# EAGLE design test_circuit1 (EAGLE 6.3)
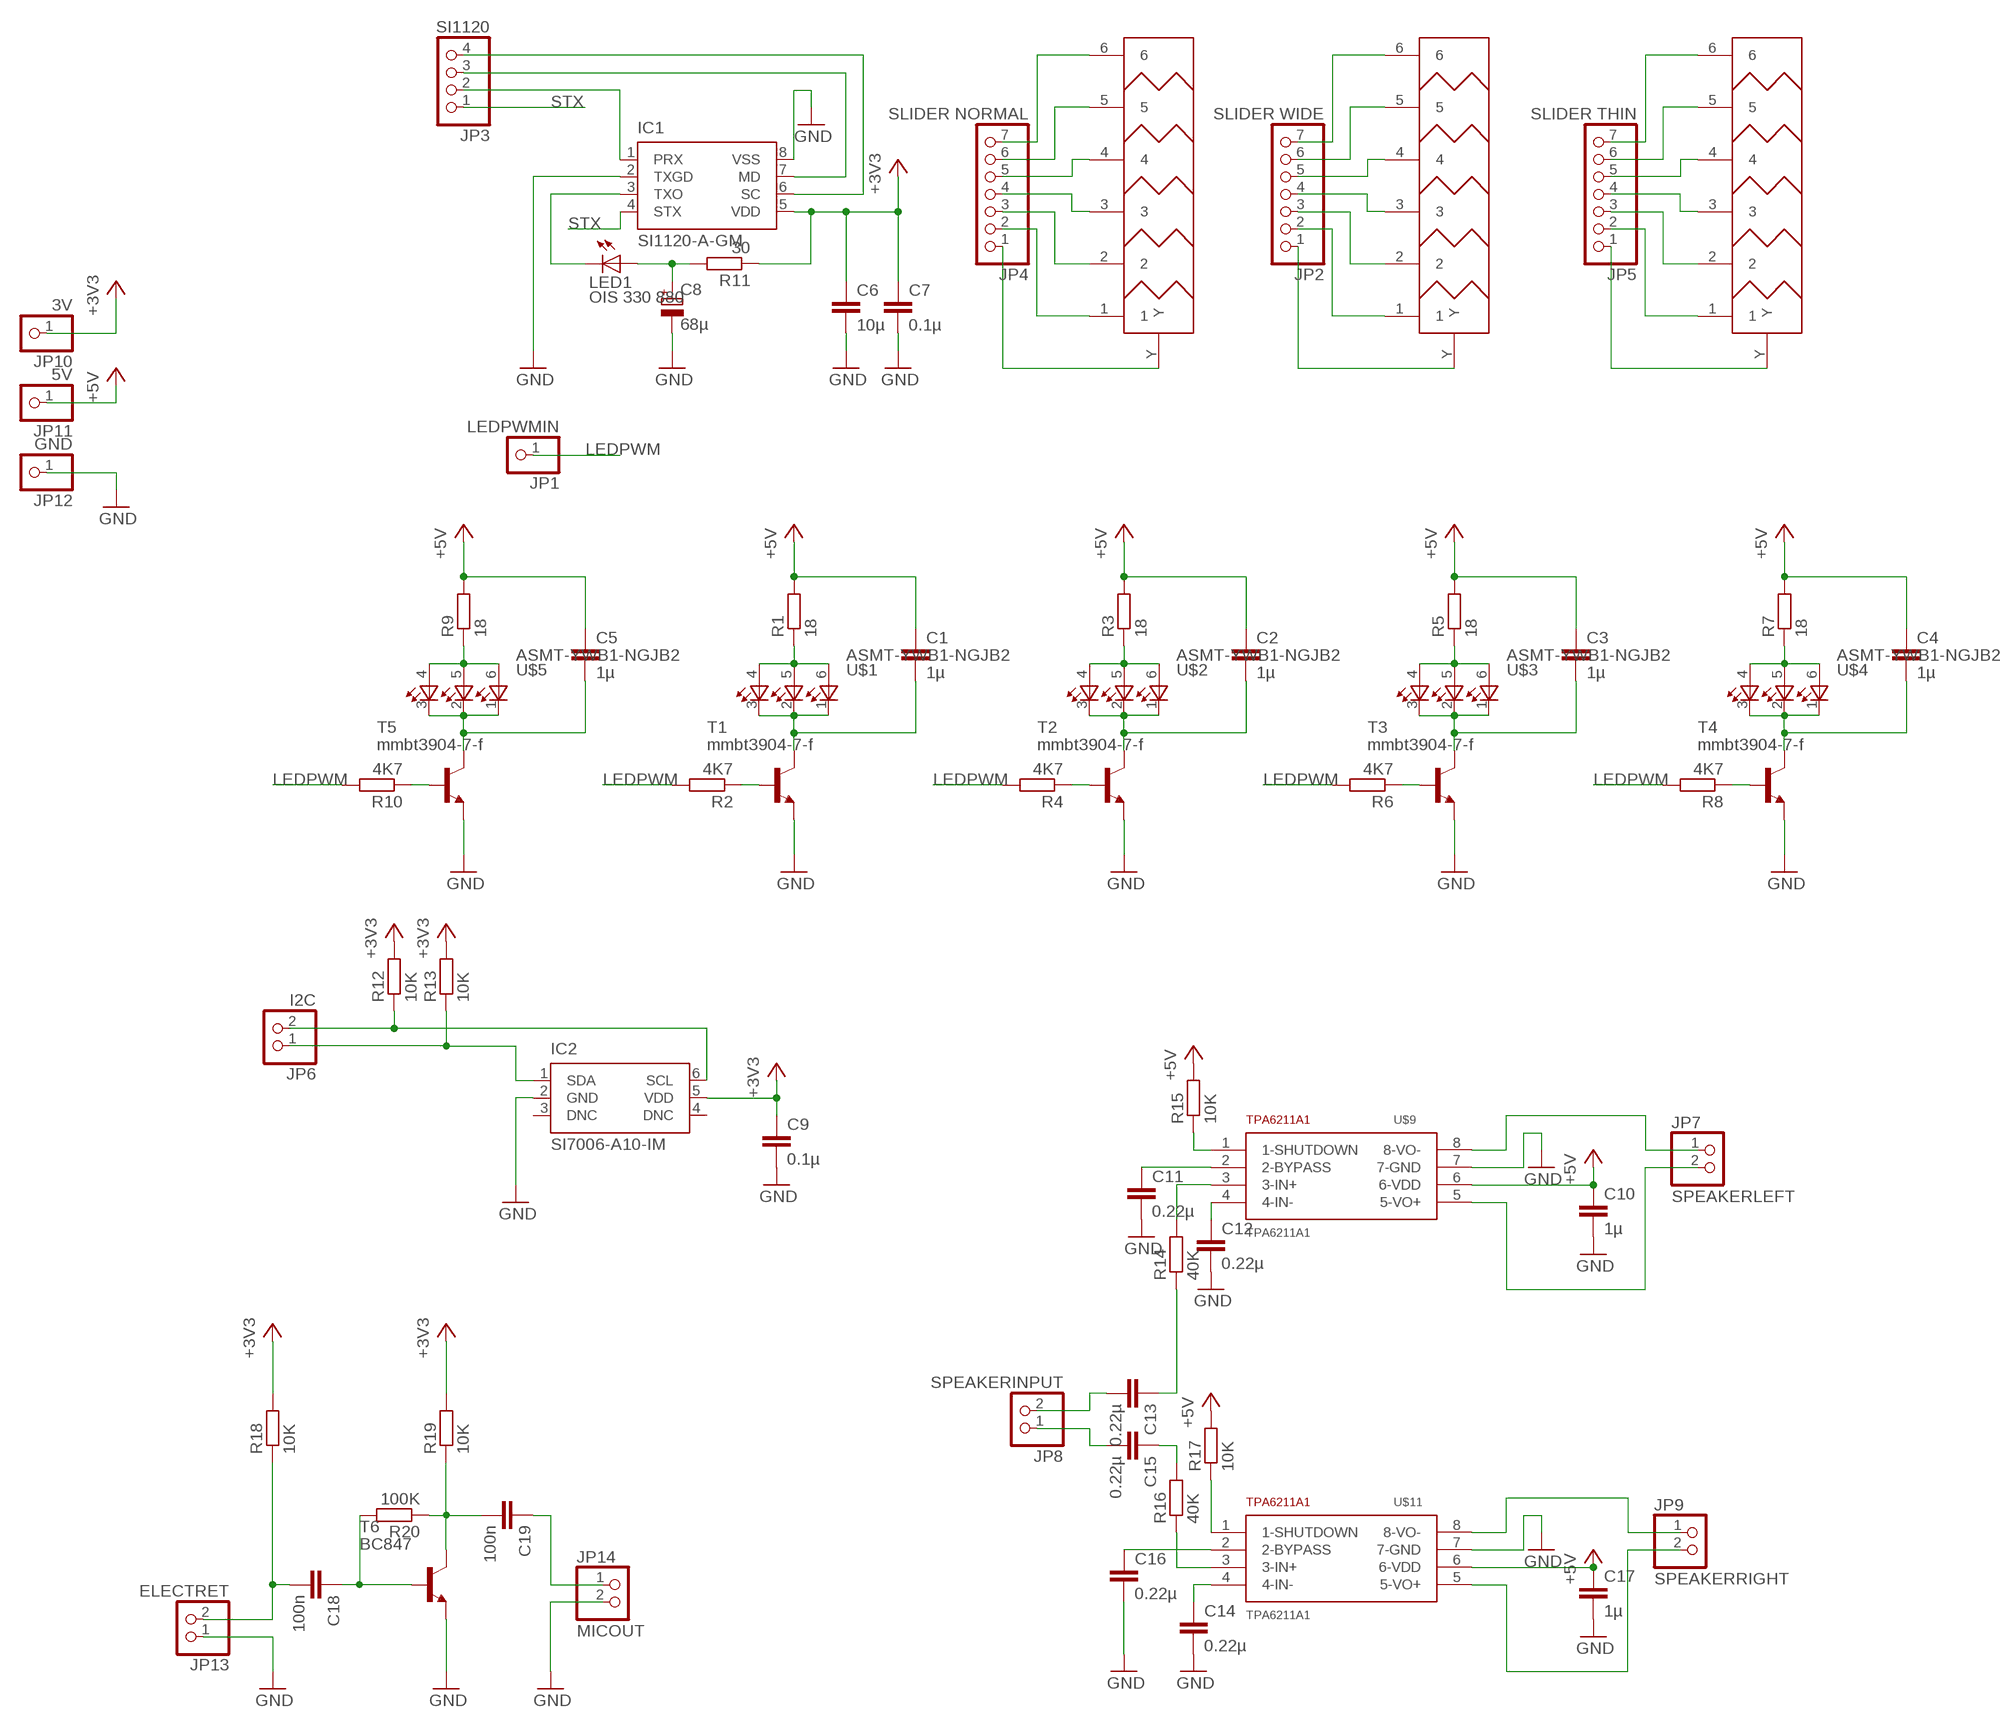
[diagram p0: schematic, sheet 1]

## Parts
C1  1µ  C-EUC0805  [C0805]
C2  1µ  C-EUC0805  [C0805]
C3  1µ  C-EUC0805  [C0805]
C4  1µ  C-EUC0805  [C0805]
C5  1µ  C-EUC0805  [C0805]
C6  10µ  C-EUC0805  [C0805]
C7  0.1µ  C-EUC0805  [C0805]
C8  68µ  CPOL-EUE2.5-7  [E2,5-7]
C9  0.1µ  C-EUC0805  [C0805]
C10  1µ  C-EUC0805  [C0805]
C11  0.22µ  C-EUC0805  [C0805]
C12  0.22µ  C-EUC0805  [C0805]
C13  0.22µ  C-EUC0805  [C0805]
C14  0.22µ  C-EUC0805  [C0805]
C15  0.22µ  C-EUC0805  [C0805]
C16  0.22µ  C-EUC0805  [C0805]
C17  1µ  C-EUC0805  [C0805]
C18  100n  C-EUC0805  [C0805]
C19  100n  C-EUC0805  [C0805]
IC1  SI1120-A-GM  [ODFN8-3X3]
IC2  SI7006-A10-IM  [DFN6-3X3]
JP1  LEDPWMIN  PINHD-1X1  [1X01]
JP2  SLIDER WIDE  PINHD-1X7  [1X07]
JP3  SI1120  PINHD-1X4  [1X04]
JP4  SLIDER NORMAL  PINHD-1X7  [1X07]
JP5  SLIDER THIN  PINHD-1X7  [1X07]
JP6  I2C  PINHD-1X2  [1X02]
JP7  SPEAKERLEFT  PINHD-1X2  [1X02]
JP8  SPEAKERINPUT  PINHD-1X2  [1X02]
JP9  SPEAKERRIGHT  PINHD-1X2  [1X02]
JP10  3V  PINHD-1X1  [1X01]
JP11  5V  PINHD-1X1  [1X01]
JP12  GND  PINHD-1X1  [1X01]
JP13  ELECTRET  PINHD-1X2  [1X02]
JP14  MICOUT  PINHD-1X2  [1X02]
LED1  OIS 330 880  LEDSML1206  [SML1206]
R1  18  R-EU_R0805  [R0805]
R2  4K7  R-EU_R0805  [R0805]
R3  18  R-EU_R0805  [R0805]
R4  4K7  R-EU_R0805  [R0805]
R5  18  R-EU_R0805  [R0805]
R6  4K7  R-EU_R0805  [R0805]
R7  18  R-EU_R0805  [R0805]
R8  4K7  R-EU_R0805  [R0805]
R9  18  R-EU_R0805  [R0805]
R10  4K7  R-EU_R0805  [R0805]
R11  30  R-EU_R0805  [R0805]
R12  10K  R-EU_R0805  [R0805]
R13  10K  R-EU_R0805  [R0805]
R14  40K  R-EU_R0805  [R0805]
R15  10K  R-EU_R0805  [R0805]
R16  40K  R-EU_R0805  [R0805]
R17  10K  R-EU_R0805  [R0805]
R18  10K  R-EU_R0805  [R0805]
R19  10K  R-EU_R0805  [R0805]
R20  100K  R-EU_R0805  [R0805]
T1  mmbt3904-7-f  -NPN-SOT23-EBC  [SOT23-EBC]
T2  mmbt3904-7-f  -NPN-SOT23-EBC  [SOT23-EBC]
T3  mmbt3904-7-f  -NPN-SOT23-EBC  [SOT23-EBC]
T4  mmbt3904-7-f  -NPN-SOT23-EBC  [SOT23-EBC]
T5  mmbt3904-7-f  -NPN-SOT23-EBC  [SOT23-EBC]
T6  BC847  [SOT23]
U$1  ASMT-YWB1-NGJB2  [ASMT-YWB1-NGJB2]
U$2  ASMT-YWB1-NGJB2  [ASMT-YWB1-NGJB2]
U$3  ASMT-YWB1-NGJB2  [ASMT-YWB1-NGJB2]
U$4  ASMT-YWB1-NGJB2  [ASMT-YWB1-NGJB2]
U$5  ASMT-YWB1-NGJB2  [ASMT-YWB1-NGJB2]
U$6  SLIDER160MM_RESINT  [SLIDER160MM_RI]
U$7  SLIDER16MM_RESINT_WIDEY  [SLIDER160MM_RI_WIDERY]
U$8  SLIDER160MM_RESINT_THIN  [SLIDER160MM_RI_THIN]
U$9  TPA6211A1  [MSOP8]
U$11  TPA6211A1  [MSOP8]

## Nets
+3V3: C6.1 C7.1 C9.1 IC1.5(VDD) IC2.5(VDD) JP10.1 R11.1 R12.2 R13.2 R18.2 R19.2
+5V: C1.1 C2.1 C3.1 C4.1 C5.1 C10.1 C17.1 JP11.1 R1.2 R3.2 R5.2 R7.2 R9.2 R15.2 R17.2 U$9.6(6-VDD) U$11.6(6-VDD)
GND: C6.2 C7.2 C8.- C9.2 C10.2 C11.2 C12.2 C14.2 C16.2 C17.2 IC1.2(TXGD) IC1.8(VSS) IC2.2(GND) JP12.1 JP13.1 JP14.2 T1.E T2.E T3.E T4.E T5.E T6.2(E) U$9.7(7-GND) U$11.7(7-GND)
LEDPWM: JP1.1 R2.2 R4.2 R6.2 R8.2 R10.2
N$1: R1.1 U$1.4 U$1.5 U$1.6
N$2: C1.2 T1.C U$1.1 U$1.2 U$1.3
N$3: C2.2 T2.C U$2.1 U$2.2 U$2.3
N$4: R3.1 U$2.4 U$2.5 U$2.6
N$5: R2.1 T1.B
N$6: R4.1 T2.B
N$7: C3.2 T3.C U$3.1 U$3.2 U$3.3
N$8: R5.1 U$3.4 U$3.5 U$3.6
N$9: R6.1 T3.B
N$10: C4.2 T4.C U$4.1 U$4.2 U$4.3
N$11: R7.1 U$4.4 U$4.5 U$4.6
N$12: R8.1 T4.B
N$13: C5.2 T5.C U$5.1 U$5.2 U$5.3
N$14: R9.1 U$5.4 U$5.5 U$5.6
N$15: R10.1 T5.B
N$16: JP4.7 U$6.6
N$17: JP4.6 U$6.5
N$18: JP4.5 U$6.4
N$19: JP4.4 U$6.3
N$20: JP4.3 U$6.2
N$21: JP4.2 U$6.1
N$22: IC1.3(TXO) LED1.C
N$23: C8.+ LED1.A R11.2
N$24: IC1.7(MD) JP3.3
N$25: IC1.6(SC) JP3.4
N$26: IC1.1(PRX) JP3.2
N$27: JP4.1 U$6.Y
N$28: JP2.7 U$7.6
N$29: JP2.6 U$7.5
N$30: JP2.5 U$7.4
N$31: JP2.4 U$7.3
N$32: JP2.3 U$7.2
N$33: JP2.2 U$7.1
N$34: JP2.1 U$7.Y
N$35: JP5.7 U$8.6
N$36: JP5.6 U$8.5
N$37: JP5.5 U$8.4
N$38: JP5.4 U$8.3
N$39: JP5.3 U$8.2
N$40: JP5.2 U$8.1
N$41: JP5.1 U$8.Y
N$42: C13.1 R14.1
N$43: C13.2 JP8.2
N$44: IC2.6(SCL) JP6.2 R12.1
N$45: IC2.1(SDA) JP6.1 R13.1
N$46: JP7.1 U$9.8(8-VO-)
N$47: JP7.2 U$9.5(5-VO+)
N$48: C11.1 U$9.2(2-BYPASS)
N$49: C12.1 U$9.4(4-IN-)
N$50: R14.2 U$9.3(3-IN+)
N$51: C15.2 JP8.1
N$52: C15.1 R16.2
N$53: R15.1 U$9.1(1-SHUTDOWN)
N$54: R16.1 U$11.3(3-IN+)
N$55: C14.1 U$11.4(4-IN-)
N$56: C16.1 U$11.2(2-BYPASS)
N$57: R17.1 U$11.1(1-SHUTDOWN)
N$58: JP9.1 U$11.8(8-VO-)
N$59: JP9.2 U$11.5(5-VO+)
N$60: C19.2 R19.1 R20.1 T6.3(C)
N$65: C18.1 R20.2 T6.1(B)
N$66: C18.2 JP13.2 R18.1
N$67: C19.1 JP14.1
STX: IC1.4(STX) JP3.1
Unconnected: IC2.3(DNC) IC2.4(DNC)

## Library data of the parts
C1-C7 C9-C19 = resistor:C-EU: CAPACITOR, European symbol
C8 = resistor:CPOL-EU: POLARIZED CAPACITOR, European symbol
IC1 = si11xx_10:SI1120-*: Proximity/Light Sensor with PWM Output Source: http://www.silabs.com/Support%20Documents/TechnicalDocs/Si1120.pdf; MF: Silicon Labs; MPN: Si1120-A-GM; OC_FARNELL: 2422557; OC_NEWARK: unknown
IC2 = si70xx-10:SI7006-*: I2C Humidity and Temperature Sensor Source: http://www.silabs.com/Support%20Documents/TechnicalDocs/Si7006-A10.pdf; MF: Silicon Labs; MPN: Si7006-A10-IM; OC_FARNELL: unknown; OC_NEWARK: unknown
JP1 JP10-JP12 = pinhead:PINHD-1X1: PIN HEADER
JP2 JP4 JP5 = pinhead:PINHD-1X7: PIN HEADER
JP3 = pinhead:PINHD-1X4: PIN HEADER
JP6-JP9 JP13 JP14 = pinhead:PINHD-1X2: PIN HEADER
LED1 = led:LED: LED OSRAM: - CHIPLED LG R971, LG N971, LY N971, LG Q971, LY Q971, LO R971, LY R971 LH N974, LH R974 LS Q976, LO Q976, LY Q976 LO Q996 - Hyper CHIPLED LW Q18S LB Q993, LB Q99A, LB R99A - SideLED LS A670, LO A670, LY A670, LG A670, LP A670 LB A673, LV A673, LT A673, LW A673 LH A674 LY A675 LS A676, LA A676, LO A676, LY A676, LW A676 LS A679, LY A679, LG A679 - Hyper Micro SIDELED® LS Y876, LA Y876, LO Y876, LY Y876 LT Y87S - SmartLED LW L88C, LW L88S LB L89C, LB L89S, LG L890 LS L89K, LO L89K, LY L89K LS L896, LA L896, LO L896, LY L896 - TOPLED LS T670, LO T670, LY T670, LG T670, LP T670 LSG T670, LSP T670, LSY T670, LOP T670, LYG T670 LG T671, LOG T671, LSG T671 LB T673, LV T673, LT T673, LW T673 LH T674 LS T676, LA T676, LO T676, LY T676, LB T676, LH T676, LSB T676, LW T676 LB T67C, LV T67C, LT T67C, LS T67K, LO T67K, LY T67K, LW E67C LS E67B, LA E67B, LO E67B, LY E67B, LB E67C, LV E67C, LT E67C LW T67C LS T679, LY T679, LG T679 LS T770, LO T770, LY T770, LG T770, LP T770 LB T773, LV T773, LT T773, LW T773 LH T774 LS E675, LA E675, LY E675, LS T675 LS T776, LA T776, LO T776, LY T776, LB T776 LHGB T686 LT T68C, LB T68C - Hyper Mini TOPLED® LB M676 - Mini TOPLED Santana® LG M470 LS M47K, LO M47K, LY M47K Source: http://www.osram.convergy.de LUXEON: - LUMILED® LXK2-PW12-R00, LXK2-PW12-S00, LXK2-PW14-U00, LXK2-PW14-V00 LXK2-PM12-R00, LXK2-PM12-S00, LXK2-PM14-U00 LXK2-PE12-Q00, LXK2-PE12-R00, LXK2-PE12-S00, LXK2-PE14-T00, LXK2-PE14-U00 LXK2-PB12-K00, LXK2-PB12-L00, LXK2-PB12-M00, LXK2-PB14-N00, LXK2-PB14-P00, LXK2-PB14-Q00 LXK2-PR12-L00, LXK2-PR12-M00, LXK2-PR14-Q00, LXK2-PR14-R00 LXK2-PD12-Q00, LXK2-PD12-R00, LXK2-PD12-S00 LXK2-PH12-R00, LXK2-PH12-S00 LXK2-PL12-P00, LXK2-PL12-Q00, LXK2-PL12-R00 Source: www.luxeon.com KINGBRIGHT: KA-3528ASYC Source: www.kingbright.com
R1-R20 = resistor:R-EU_: RESISTOR, European symbol
T1-T5 = transistor:*-NPN-: NPN Transistror BF959 corrected 2008.03.06
T6 = transistor:BC847: NPN TRANSISTOR
U$1-U$5 = alarm:ASMT-YWB1-NGJB2
U$6 = alarm:SLIDER160MM_RESINT
U$7 = alarm:SLIDER16MM_RESINT_WIDEY
U$8 = alarm:SLIDER160MM_RESINT_THIN
U$9 U$11 = alarm:TPA6211A1

## Board
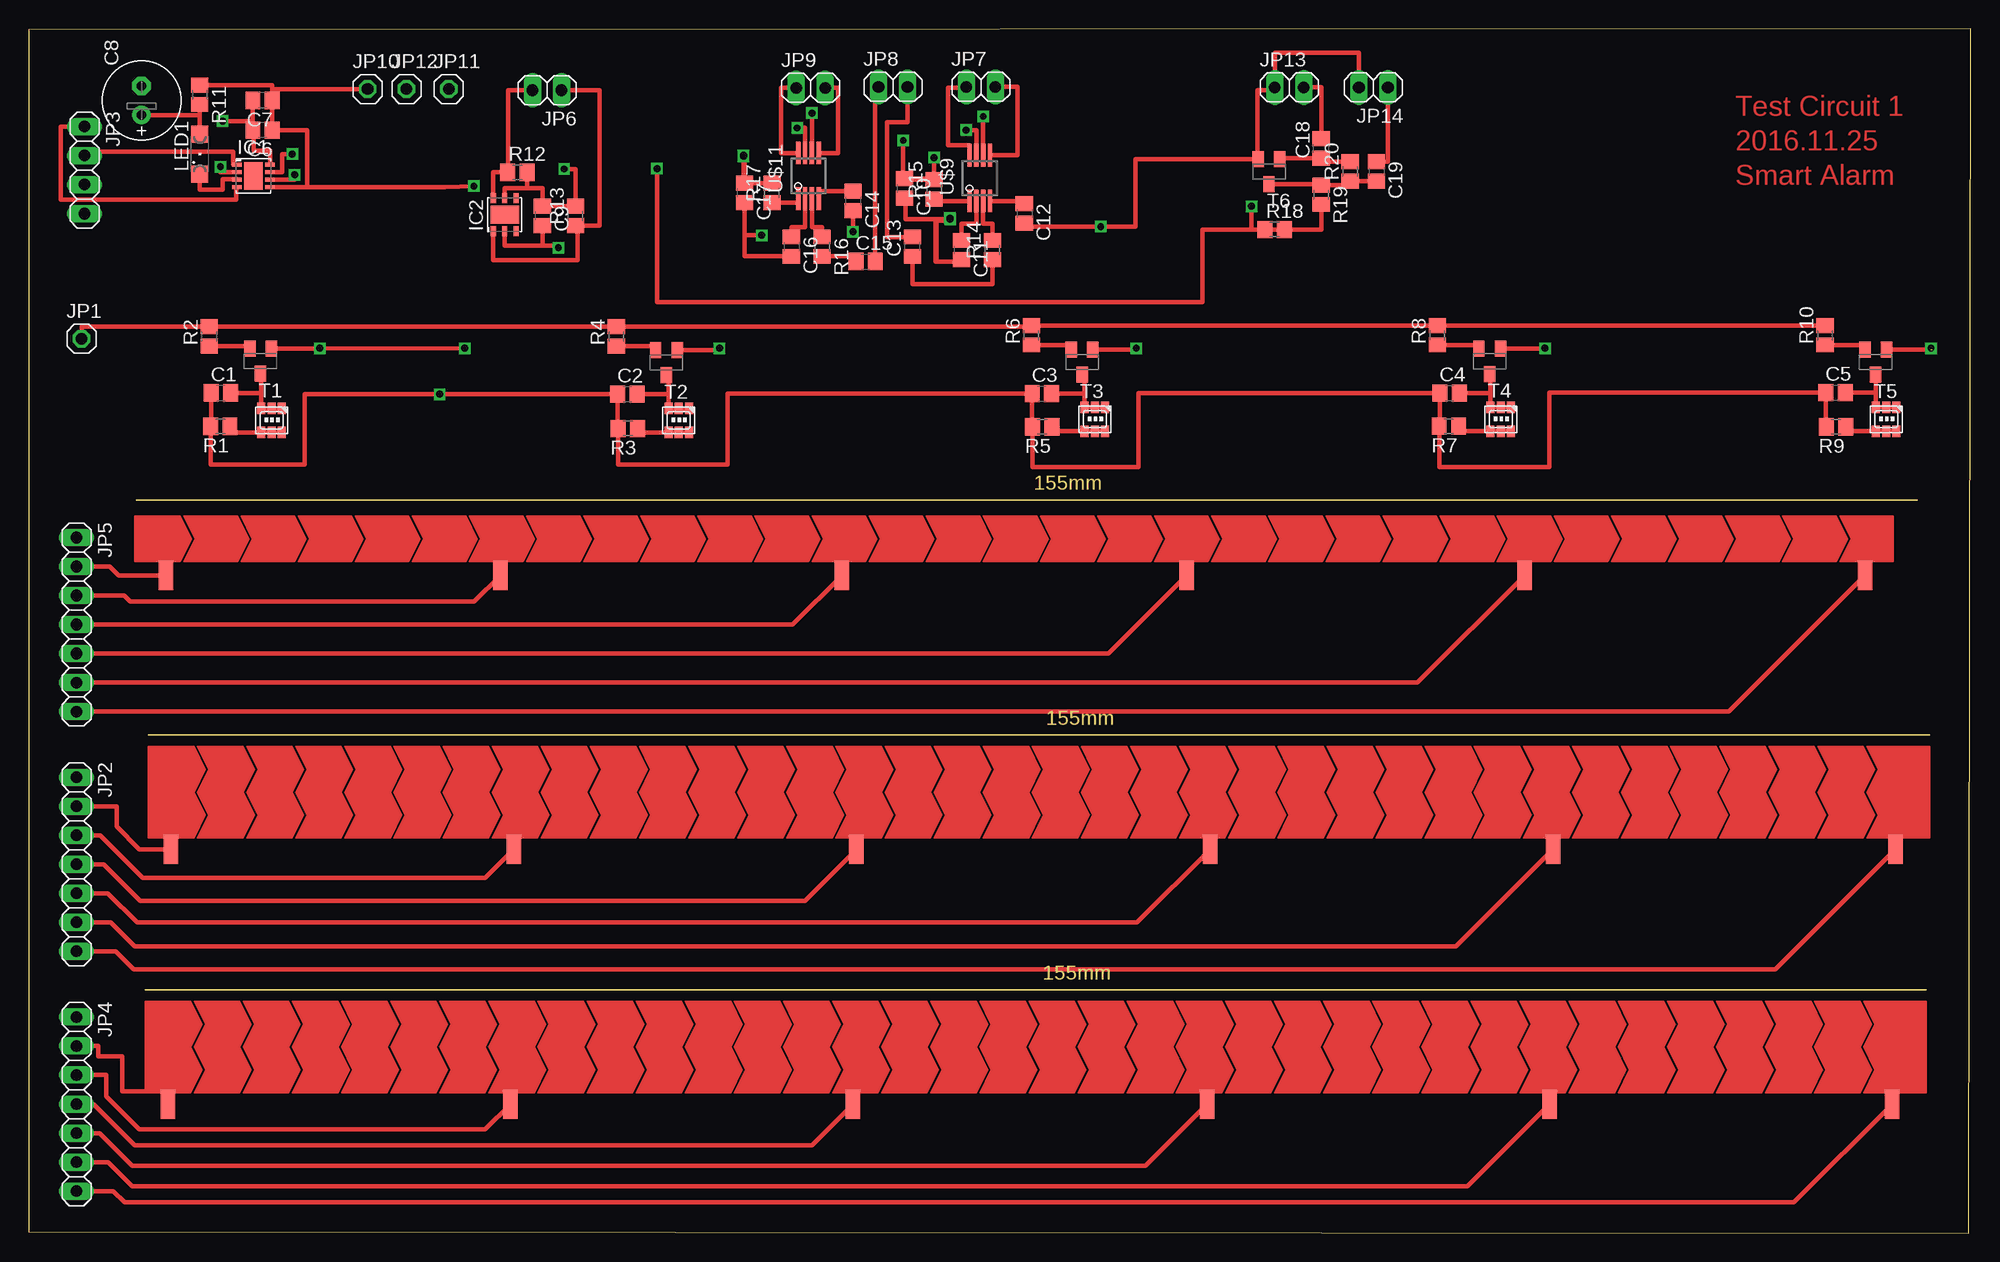
[diagram p1: board, top side]
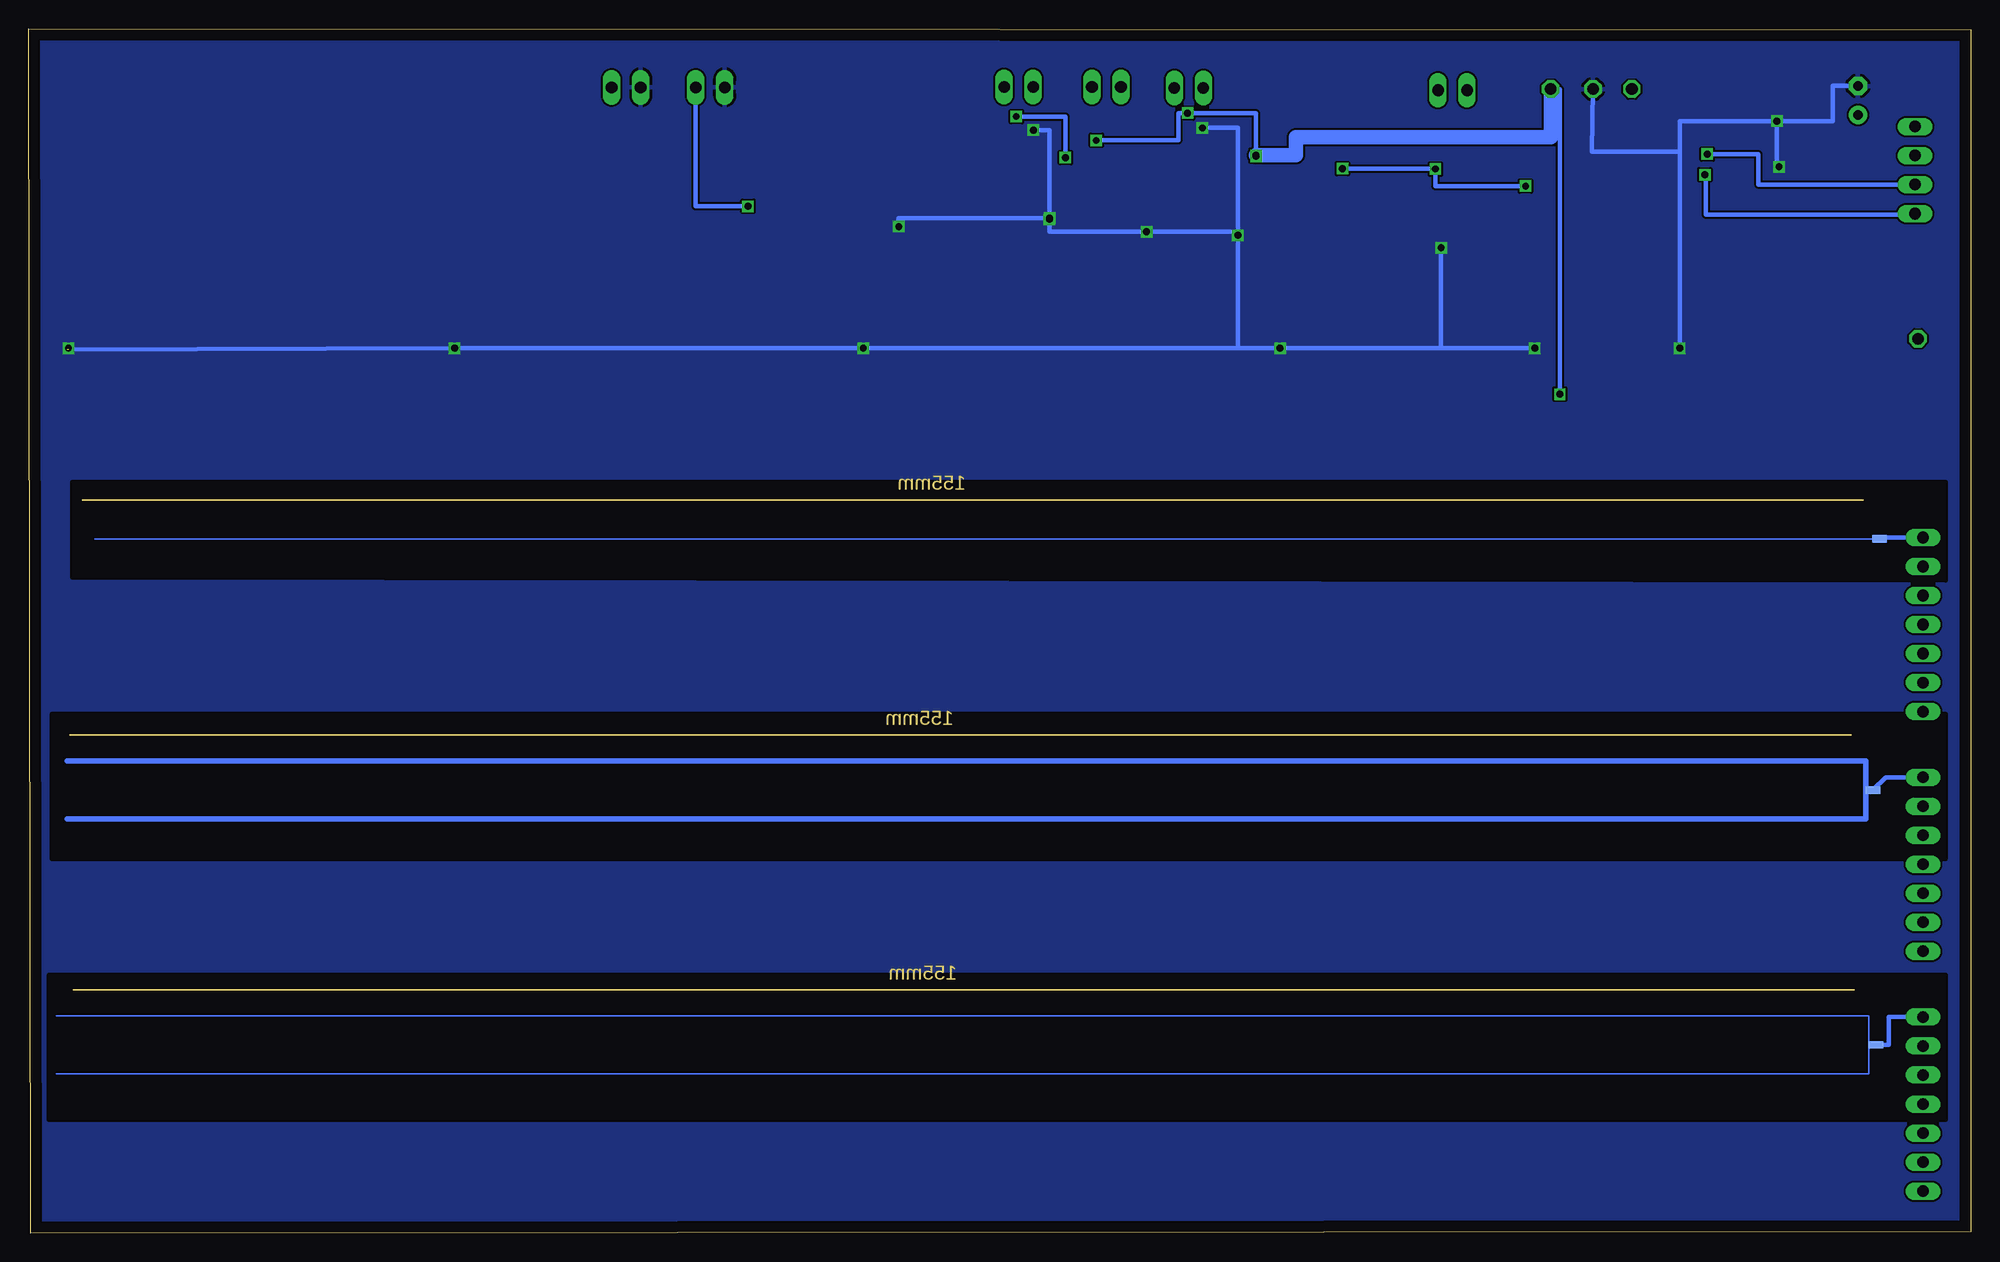
[diagram p2: board, bottom side, seen from below]

Size 170.1 x 105.5 mm. Coordinates in mm from the lower left corner, seen from the top.
Outline: 0,0.1 169.9,0 170.1,105.5 0,105.4 0,0.1
Copper layers (1*16): Top 0.035mm / dielectric 1.5mm / Bottom 0.035mm
Design rules "default *": minimum track width 10mil, minimum drill 24mil, track to track 7mil, track to pad 7mil, pad to pad 7mil, via to via 7mil, smd to smd 7mil, copper to edge 40mil, drill to drill 8mil, minimum pad ring 10mil, minimum via ring 8mil, stop-mask expansion 4mil, vias tented up to drill 0mil, thermal gap 10mil

### Footprints (pad centres in the part's own frame; a part is rotated, then mirrored left to right if it is on the bottom)
C0805 = smd 1.3 x 1.5: 1 -0.85,0; 2 0.85,0
E2,5-7 = drill 0.813 pad 1.6: + -1.27,0 | drill 0.813 pad 1.6 octagon: - 1.27,0
ODFN8-3X3 = smd 0.85 x 0.35: 1 -1.45,0.975; 2 -1.45,0.325; 3 -1.45,-0.325; 4 -1.45,-0.975; 5 1.45,-0.975; 6 1.45,-0.325; 7 1.45,0.325; 8 1.45,0.975 | smd 1.6 x 2.4: EXP 0,0
DFN6-3X3 = smd 0.85 x 0.45: 1 -1.45,1; 2 -1.45,0; 3 -1.45,-1; 4 1.45,-1; 5 1.45,0; 6 1.45,1 | smd 1.6 x 2.5: EXP 0,0
1X01 = drill 1.016 octagon: 1 0,0
1X07 = drill 1.016 long: 1 -7.62,0; 2 -5.08,0; 3 -2.54,0; 4 0,0; 5 2.54,0; 6 5.08,0; 7 7.62,0
1X04 = drill 1.016 long: 1 -3.81,0; 2 -1.27,0; 3 1.27,0; 4 3.81,0
1X02 = drill 1.016 long: 1 -1.27,0; 2 1.27,0
SML1206 = smd 1.5 x 1.5: A 1.75,0; C -1.75,0
R0805 = smd 1.3 x 1.5: 1 -0.85,0; 2 0.85,0
SOT23-EBC = smd 1 x 1.4: B 0.95,-1.1; C 0,1.1; E -0.95,-1.1
SOT23 = smd 1 x 1.4: 1 -0.95,-1.1; 2 0.95,-1.1; 3 0,1.1
ASMT-YWB1-NGJB2 = smd 1 x 0.7: 1 2.2,-2.3; 2 2.2,-1.4; 3 2.2,-0.5; 4 0.1,-0.5; 5 0.1,-1.4; 6 0.1,-2.3
SLIDER160MM_RI = smd 1.27 x 2.54: 1 2,-9; 2 32,-9; 3 62,-9; 4 93,-9; 5 123,-9; 6 153,-9 | smd 1.27 x 0.635 bottom: Y -1.905,-3.81
SLIDER160MM_RI_WIDERY = smd 1.27 x 2.54: 1 -78.01,-5.19; 2 -48.01,-5.19; 3 -18.01,-5.19; 4 12.99,-5.19; 5 42.99,-5.19; 6 72.99,-5.19 | smd 1.27 x 0.635 bottom: Y -81.915,0
SLIDER160MM_RI_THIN = smd 1.27 x 2.54: 1 -79.28,-5.19; 2 -49.98,-5.19; 3 -20.08,-5.19; 4 10.12,-5.19; 5 39.72,-5.19; 6 69.52,-5.19 | smd 1.27 x 0.635 bottom: Y -83.285,-2
MSOP8 = smd 0.38 x 2: 1 -1.8,-2.4; 2 -1.2,-2.4; 3 -0.6,-2.4; 4 0,-2.4; 5 0,1.6; 6 -0.6,1.6; 7 -1.2,1.6; 8 -1.8,1.6

### Placement (x,y rotation side)
C1  16.84,73.59 0 top
C2  52.44,73.48 0 top
C3  88.74,73.53 0 top
C4  124.44,73.58 0 top
C5  158.24,73.63 0 top
C6  20.5,96.6 180 top
C7  20.5,99.2 180 top
C8  9.9,99.2 90 top
C9  45,89.1 270 top
C10  76.7,91.5 270 top
C11  81.7,86.1 270 top
C12  87.2,89.3 270 top
C13  77.4,86.4 90 top
C14  72.2,90.4 270 top
C15  73.3,85.1 0 top
C16  66.8,86.4 270 top
C17  62.7,91.1 270 top
C18  113.2,95.01 90 top
C19  118.02,92.98 270 top
IC1  19.7,92.6 0 top
IC2  41.7,89.2 90 top
JP1  4.64,78.33 0 top
JP2  4.2,32.3 270 top
JP3  4.9,93.1 270 top
JP4  4.2,11.3 270 top
JP5  4.2,53.3 270 top
JP6  45.4,100.1 180 top
JP7  83.4,100.4 0 top
JP8  75.7,100.4 0 top
JP9  68.5,100.3 0 top
JP10  29.7,100.2 0 top
JP11  36.8,100.2 0 top
JP12  33.1,100.2 0 top
JP13  110.4,100.34 0 top
JP14  117.77,100.34 180 top
LED1  15,94.5 90 top
R1  16.79,70.66 180 top
R2  15.82,78.54 90 top
R3  52.48,70.47 180 top
R4  51.47,78.54 90 top
R5  88.78,70.62 180 top
R6  87.82,78.64 90 top
R7  124.38,70.67 180 top
R8  123.37,78.64 90 top
R9  158.28,70.62 180 top
R10  157.32,78.64 90 top
R11  15,99.7 270 top
R12  42.8,92.9 0 top
R13  47.9,89.1 90 top
R14  84.4,86.1 90 top
R15  79.3,91.4 90 top
R16  69.5,86.4 270 top
R17  65.1,91.1 90 top
R18  109.13,87.9 0 top
R19  113.2,90.95 270 top
R20  115.74,92.98 90 top
T1  20.32,76.36 180 top
T2  55.86,76.25 180 top
T3  92.26,76.3 180 top
T4  127.96,76.35 180 top
T5  161.76,76.3 180 top
T6  108.63,92.98 180 top
U$1  19.88,70.03 90 top
U$2  55.53,70.03 90 top
U$3  91.98,70.13 90 top
U$4  127.53,70.13 90 top
U$5  161.28,70.13 90 top
U$6  10.2,20.3 0 top
U$7  90.5,38.8 0 top
U$8  91.3,62.8 0 top
U$9  84.2,92.8 0 top
U$11  69.2,93 0 top

### Tracks (layer width: path | path; a pad name or v marks a point on that pad's centre or on a via)
+3V3  (via drill 0.6)
  Top 0.406: C7.1 C6.1 24.4,96.6 24.4,91.62 | IC1.5 24.4,91.62 | R11.1 21.35,100.55 C7.1 | IC2.5 41.7,91.5 43.65,91.5 | 43.65,91.5 45,91.5 C9.1 R13.2 47.9,93.2 v46.9,93.2 | 43.65,91.5 R12.2 | 24.4,91.62 36.5,91.62 v39,91.7 | JP10.1 21.35,100.2 C7.1 | R19.2 113.2,87.9 R18.2 102.78,87.9 102.78,81.55 55.03,81.55 v55.03,93.23
  Bottom 0.406: v39,91.7 46.9,91.7 v46.9,93.2 46.9,93.23 v55.03,93.23
+5V  (via drill 0.6)
  Top 0.406: C1.1 15.99,70.66 R1.2 15.94,67.3 24.2,67.3 24.2,73.48 v36,73.48 C2.1 51.59,70.47 R3.2 51.63,67.3 61.2,67.3 61.2,73.53 C3.1 87.89,70.62 R5.2 87.93,67.1 97.2,67.1 97.2,73.58 C4.1 123.59,70.67 R7.2 123.53,67.1 133.2,67.1 133.2,73.63 C5.1 157.39,70.62 R9.2 | C17.1 R17.2 65.4,91.95 65.4,92.5 | U$11.6 v68.6,98.1 | v62.6,94.3 62.7,94.3 C17.1 | U$9.6 v83.6,97.8 | C10.1 79.3,92.35 R15.2 | v79.3,94.2 R15.2 | R15.2 76.6,92.25 v76.6,95.7 | C17.1 62.6,91.95 v62.6,94.4
  Bottom 0.406: v62.6,94.3 v62.6,94.4 62.6,98.1 v68.6,98.1 69.4,98.1 69.4,95.7 v76.6,95.7 | v83.6,97.8 79.3,97.8 v79.3,94.2 | JP11.1 36,100.2 v36,73.48
  Bottom 1.27: v62.6,94.4 59.1,94.4 59.1,96 36.8,96 JP11.1
GND  (via drill 0.6)  (1 unrouted)
  Top 0.406: 25.1,77.46 25.2,77.46 v38.2,77.5 | T2.E 60.5,77.35 v60.5,77.5 | T3.E 97,77.4 v97,77.5 | T4.E 132.8,77.45 v132.8,77.5 | 166.7,77.4 T5.E | 19.65,97.4 C6.2 19.7,96.6 19.7,94.8 21.15,94.8 IC1.8 | 19.65,97.4 C7.2 | IC1.2 16.8,92.92 v16.8,93.4 | v17,97.4 19.65,97.4 | T1.E 25.1,77.46 | 25.1,77.46 v25.5,77.5 | IC2.2 41.7,86.5 45,86.5 | 45,86.5 C9.2 | 45,86.5 46.4,86.5 v46.4,86.3 | C16.2 62.7,85.55 62.7,87.4 | 62.7,87.4 C17.2 | U$11.7 68,96.8 v67.3,96.8 | v64.2,87.4 62.7,87.4 | C10.2 76.8,90.65 76.8,88.8 79.5,88.8 | 79.5,88.8 79.5,85.1 81.7,85.1 C11.2 81.19,85.25 81.19,85.1 79.42,85.1 79.42,88.66 80.69,88.66 v80.69,88.91 | U$9.7 83,96.6 v82.1,96.6 | v80.7,88.8 79.5,88.8 | C14.2 v72.2,87.7 | JP14.2 116.5,103.39 109.13,103.39 JP13.1 109.13,100.09 107.61,100.09 107.61,94.08 T6.2 96.94,94.08 96.94,88.15 v93.89,88.15 87.2,88.15 C12.2
  Bottom 0.406: v38.2,77.5 46.4,77.5 | 46.4,77.5 v60.5,77.5 | v60.5,77.5 v97,77.5 v132.8,77.5 166.6,77.4 | v16.8,93.4 17,93.4 v17,97.4 | v17,97.4 12.1,97.4 12.1,100.5 9.9,100.5 C8.- | 25.5,77.2 v25.5,77.5 25.5,94.7 | 25.5,94.7 25.5,97.4 v17,97.4 | v46.4,86.3 46.4,77.5 | v67.3,96.8 64.2,96.8 v64.2,87.4 | v82.1,96.6 80.7,96.6 v80.7,88.8 80.7,87.7 v72.2,87.7 64.2,87.7 v64.2,87.4 | v60.5,77.5 64.2,77.5 v64.2,87.4 | JP12.1 33.2,94.7 25.5,94.7 | v80.69,88.91 93.89,88.91 v93.89,88.15
  other vias: 166.6,77.5
  pour Bottom: 0.42,104.92 169.59,104.92 169.59,0.27 0.42,0.27
LEDPWM
  Top 0.406: JP1.1 4.64,79.39 R2.2 R4.2 87.82,79.39 R6.2 R8.2 R10.2
N$1
  Top 0.406: U$1.6 U$1.5 U$1.4 17.64,70.13 R1.1
N$2
  Top 0.406: T1.C 20.38,75.26 20.38,73.59 | U$1.1 22.1,72.23 | 22.1,72.23 22.1,72.3 | 22.1,72.23 22.1,72.2 21.28,72.2 U$1.2 U$1.3 20.38,72.8 20.38,73.59 | C1.2 20.38,73.59
N$3
  Top 0.406: T2.C 56.03,75.15 56.03,73.6 56.03,73.48 | 56.03,73.48 U$2.3 U$2.2 U$2.1 | C2.2 56.03,73.48
N$4
  Top 0.406: U$2.4 U$2.5 U$2.6 53.33,70.13 R3.1
N$5
  Top 0.406: R2.1 19.37,77.69 T1.B
N$6
  Top 0.406: R4.1 54.91,77.69 T2.B
N$7
  Top 0.406: T3.C 92.48,75.2 92.48,73.53 | U$3.1 U$3.2 U$3.3 92.48,73.4 92.48,73.53 | C3.2 92.48,73.53
N$8
  Top 0.406: U$3.6 U$3.5 U$3.4 89.63,70.23 R5.1
N$9
  Top 0.406: R6.1 91.31,77.79 T3.B
N$10
  Top 0.406: T4.C 128.03,75.25 128.03,73.7 128.03,73.58 | 128.03,73.58 U$4.3 U$4.2 U$4.1 | C4.2 128.03,73.58
N$11
  Top 0.406: U$4.6 U$4.5 U$4.4 125.23,70.23 R7.1
N$12
  Top 0.406: R8.1 127.01,77.79 T4.B
N$13
  Top 0.406: T5.C 161.78,75.2 161.78,73.7 161.78,73.63 | 161.78,73.63 U$5.3 U$5.2 U$5.1 | C5.2 161.78,73.63
N$14
  Top 0.406: U$5.4 U$5.5 U$5.6 159.13,70.23 R9.1
N$15
  Top 0.406: R10.1 160.81,77.79 T5.B
N$16
  Top 0.406: JP4.7 7.42,3.68 8.4,2.7 154.6,2.7 U$6.6
N$17
  Top 0.406: JP4.6 6.98,6.22 9.1,4.1 126,4.1 U$6.5
N$18
  Top 0.406: JP4.5 6.24,8.76 9.1,5.9 97.8,5.9 U$6.4
N$19
  Top 0.406: JP4.4 5.7,11.3 9.3,7.7 68.6,7.7 U$6.3
N$20
  Top 0.406: JP4.3 6.8,13.84 6.8,12 9.7,9.1 40,9.1 U$6.2
N$21
  Top 0.406: JP4.2 6.1,16.38 6.1,15.5 8.2,15.5 8.2,12.4 12.3,12.4 12.3,11.3 | 12.3,10.4 12.3,10.68 12.3,11.3 | U$6.1 12.3,11.3
N$22
  Top 0.406: IC1.3 18.25,92.3 17,92.3 17,91.4 15,91.4 LED1.C
N$23
  Top 0.406: LED1.A 15,97.9 15,97.93 | 15,97.93 R11.2 | C8.+ 15,97.93
N$24  (via drill 0.6)
  Top 0.406: v23.1,94.5 22.2,94.5 22.2,92.9 21.15,92.9 IC1.7
  Bottom 0.406: JP3.3 18.6,91.83 18.6,94.5 v23.1,94.5
N$25  (via drill 0.6)
  Top 0.406: IC1.6 23.3,92.27 v23.3,92.7
  Bottom 0.406: v23.3,92.7 23.2,92.7 23.2,89.2 4.9,89.2 JP3.4
N$26
  Top 0.406: IC1.1 17.9,93.58 17.9,94.7 4.9,94.7 JP3.2
N$27
  Bottom 0.406: JP4.1 7.2,18.92 7.2,16.5 U$6.Y
N$28
  Top 0.406: JP2.7 7.62,24.68 9.2,23.1 152.98,23.1 U$7.6
N$29
  Top 0.406: JP2.6 7.18,27.22 9.3,25.1 124.98,25.1 U$7.5
N$30
  Top 0.406: JP2.5 6.94,29.76 9.5,27.2 97.08,27.2 U$7.4
N$31
  Top 0.406: JP2.4 6.6,32.3 9.8,29.1 67.98,29.1 U$7.3
N$32
  Top 0.406: JP2.3 6.26,34.84 10,31.1 39.98,31.1 U$7.2
N$33
  Top 0.406: JP2.2 7.7,37.38 7.7,35.6 9.7,33.6 U$7.1
N$34
  Bottom 0.406: JP2.1 7.46,39.92 U$7.Y
N$35
  Top 0.406: JP5.7 148.89,45.68 U$8.6
N$36
  Top 0.406: JP5.6 121.63,48.22 U$8.5
N$37
  Top 0.406: JP5.5 94.57,50.76 U$8.4
N$38
  Top 0.406: JP5.4 66.91,53.3 U$8.3
N$39
  Top 0.406: JP5.3 8.36,55.84 8.9,55.3 39.01,55.3 U$8.2
N$40
  Top 0.406: JP5.2 7.12,58.38 7.9,57.6 U$8.1
N$41
  Bottom 0.406: JP5.1 7.9,60.92 U$8.Y
N$42
  Top 0.406: R14.1 84.4,83.1 77.4,83.1 C13.1
N$43
  Top 0.406: C13.2 75.2,87.25 75.2,97.3 76.97,97.3 JP8.2
N$44
  Top 0.406: IC2.6 40.7,92.9 R12.1 42,92.9 42,100.1 JP6.2
N$45
  Top 0.406: IC2.1 40.7,85.2 48.1,85.2 48.1,88.25 R13.1 50,88.25 50,100.1 JP6.1
N$46
  Top 0.406: U$9.8 82.4,95.3 80.5,95.3 80.5,100.3 82.13,100.3 JP7.1
N$47
  Top 0.406: U$9.5 86.6,94.4 86.6,100.4 JP7.2
N$48
  Top 0.406: U$9.2 83,88.4 81.7,88.4 C11.1
N$49
  Top 0.406: U$9.4 87.2,90.4 C12.1
N$50
  Top 0.406: U$9.3 83.6,88.4 84.4,88.4 R14.2
N$51
  Top 0.406: JP8.1 74.15,100.4 C15.2
N$52
  Top 0.406: R16.2 72.45,85.55 C15.1
N$53
  Top 0.406: U$9.1 79.3,90.4 R15.1
N$54
  Top 0.406: U$11.3 68.6,88.1 69.5,88.1 R16.1
N$55
  Top 0.406: C14.1 69.2,91.25 U$11.4
N$56
  Top 0.406: U$11.2 68,88.1 66.8,88.1 C16.1
N$57
  Top 0.406: R17.1 67.4,90.25 U$11.1
N$58
  Top 0.406: JP9.1 65.9,100.3 65.9,94.6 U$11.8
N$59
  Top 0.406: U$11.5 70.9,94.6 70.9,100.3 JP9.2
N$60
  Top 0.406: C19.2 R20.1 115.74,91.8 R19.1 113.2,91.88 T6.3
N$61
  cutout Bottom: 2.2,65.8 2.2,57.16 166.28,57.42 166.28,65.8
N$62
  cutout Bottom: 2.2,43.96 2.2,32.78 168.06,32.78 168.06,45.48 2.2,45.48 2.2,44.21
N$64
  cutout Bottom: 2.2,22.62 2.2,9.92 168.32,9.92 168.32,22.62
N$65
  Top 0.406: R20.2 113.2,93.83 C18.1 109.58,94.16 T6.1
N$66  (via drill 0.6)
  Top 0.406: JP13.2 113.2,100.34 C18.2 | R18.1 107.1,87.9 v107.1,89.93
  Bottom 0.406: v107.1,89.93 111.67,89.93 JP13.2
N$67
  Top 0.406: C19.1 119.04,93.83 JP14.1
STX
  Top 0.406: IC1.4 18.2,91.62 18.2,90.5 2.8,90.5 2.8,96.9 JP3.1

### Text on the board
Top: Test Circuit 1 | 2016.11.25 | Smart Alarm